# Altium project LED Driver and Switch Breakout.PrjPcb
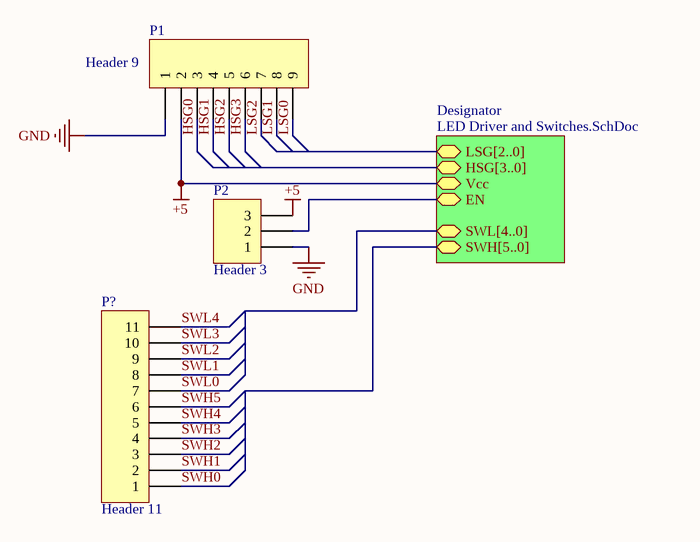
[diagram p0: LED Driver and Switch Breakout.SchDoc]
1 sheet, 3 parts. Net scope: hierarchical (ports join the sheet entries above them; power ports are global).
Board file: LED Driver and Switch Breakout.PcbDoc

## Sheet LED Driver and Switch Breakout.SchDoc
size A4; SheetNumber: 1; SheetTotal: 2

### Parts
P1  Header 9  [HDR1X9]
P2  Header 3  [HDR1X3]
P?  Header 11  [HDR1X11]

### Sub-sheets
Designator = LED Driver and Switches.SchDoc (file not in this document): LSG[2..0] (bidir), HSG[3..0] (bidir), Vcc (bidir), EN (bidir), SWL[4..0] (bidir), SWH[5..0] (bidir)

### Nets
+5: P1.2 P2.3 ; sheet Designator/Vcc
GND: P1.1 P2.1
HSG0: P1.3
HSG1: P1.4
HSG2: P1.5
HSG3: P1.6
LSG0: P1.9
LSG1: P1.8
LSG2: P1.7
SWH0: P?.1
SWH1: P?.2
SWH2: P?.3
SWH3: P?.4
SWH4: P?.5
SWH5: P?.6
SWL0: P?.7
SWL1: P?.8
SWL2: P?.9
SWL3: P?.10
SWL4: P?.11
NetP2_2: P2.2 ; sheet Designator/EN

### Library data of the parts
P1 = Header 9: Header, 9-Pin; LatestRevisionDate: 17-Jul-2002; LatestRevisionNote: Re-released for DXP Platform.; Publisher: Altium Limited
P2 = Header 3: Header, 3-Pin; LatestRevisionDate: 17-Jul-2002; LatestRevisionNote: Re-released for DXP Platform.; Publisher: Altium Limited
P? = Header 11: Header, 11-Pin; LatestRevisionDate: 17-Jul-2002; LatestRevisionNote: Re-released for DXP Platform.; Publisher: Altium Limited